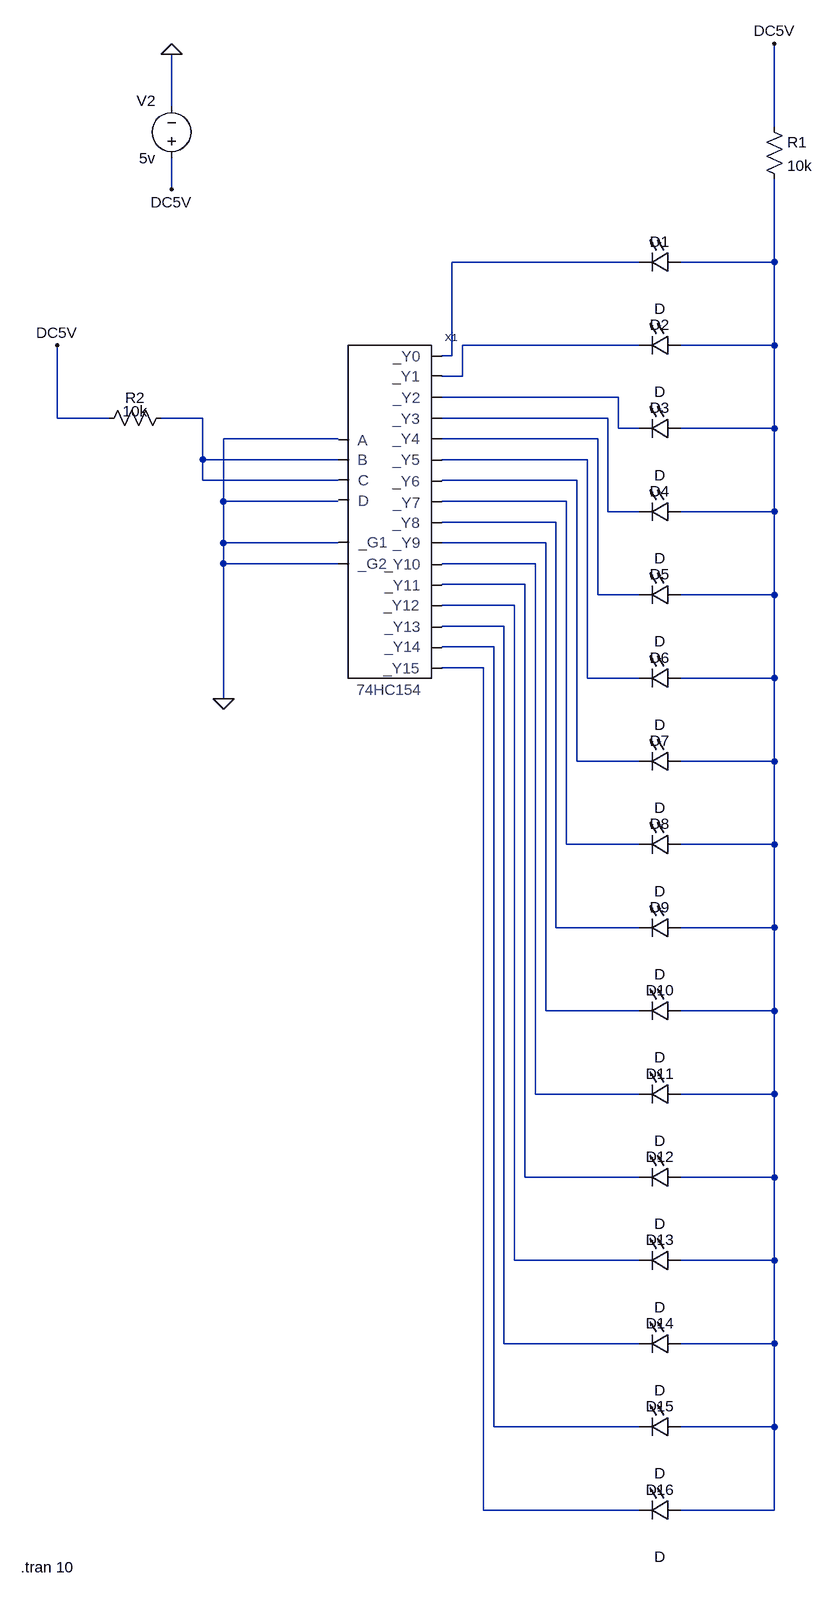
[diagram p0: schematic 74HC154_test.asc]
74HC154_test.asc, the LTspice schematic file:
Version 4
SHEET 1 880 1932
WIRE -272 -336 -272 -416
WIRE 656 -304 656 -432
WIRE -272 -208 -272 -256
WIRE 448 -96 160 -96
WIRE 656 -96 656 -224
WIRE 656 -96 512 -96
WIRE 448 32 176 32
WIRE 656 32 656 -96
WIRE 656 32 512 32
WIRE 160 48 160 -96
WIRE 160 48 144 48
WIRE 176 80 176 32
WIRE 176 80 144 80
WIRE 416 112 144 112
WIRE -448 144 -448 32
WIRE -368 144 -448 144
WIRE -224 144 -288 144
WIRE 400 144 144 144
WIRE 416 160 416 112
WIRE 448 160 416 160
WIRE 656 160 656 32
WIRE 656 160 512 160
WIRE -16 176 -192 176
WIRE 384 176 144 176
WIRE -224 208 -224 144
WIRE -16 208 -224 208
WIRE 368 208 144 208
WIRE -224 240 -224 208
WIRE -16 240 -224 240
WIRE 352 240 144 240
WIRE -192 272 -192 176
WIRE -16 272 -192 272
WIRE 336 272 144 272
WIRE 400 288 400 144
WIRE 448 288 400 288
WIRE 656 288 656 160
WIRE 656 288 512 288
WIRE 320 304 144 304
WIRE -192 336 -192 272
WIRE -16 336 -192 336
WIRE 304 336 144 336
WIRE -192 368 -192 336
WIRE -16 368 -192 368
WIRE 288 368 144 368
WIRE 272 400 144 400
WIRE 384 416 384 176
WIRE 448 416 384 416
WIRE 656 416 656 288
WIRE 656 416 512 416
WIRE 256 432 144 432
WIRE 240 464 144 464
WIRE 224 496 144 496
WIRE 208 528 144 528
WIRE 368 544 368 208
WIRE 448 544 368 544
WIRE 656 544 656 416
WIRE 656 544 512 544
WIRE -192 576 -192 368
WIRE 352 672 352 240
WIRE 448 672 352 672
WIRE 656 672 656 544
WIRE 656 672 512 672
WIRE 336 800 336 272
WIRE 448 800 336 800
WIRE 656 800 656 672
WIRE 656 800 512 800
WIRE 320 928 320 304
WIRE 448 928 320 928
WIRE 656 928 656 800
WIRE 656 928 512 928
WIRE 304 1056 304 336
WIRE 448 1056 304 1056
WIRE 656 1056 656 928
WIRE 656 1056 512 1056
WIRE 288 1184 288 368
WIRE 448 1184 288 1184
WIRE 656 1184 656 1056
WIRE 656 1184 512 1184
WIRE 272 1312 272 400
WIRE 448 1312 272 1312
WIRE 656 1312 656 1184
WIRE 656 1312 512 1312
WIRE 256 1440 256 432
WIRE 448 1440 256 1440
WIRE 656 1440 656 1312
WIRE 656 1440 512 1440
WIRE 240 1568 240 464
WIRE 448 1568 240 1568
WIRE 656 1568 656 1440
WIRE 656 1568 512 1568
WIRE 224 1696 224 496
WIRE 448 1696 224 1696
WIRE 656 1696 656 1568
WIRE 656 1696 512 1696
WIRE 208 1824 208 528
WIRE 448 1824 208 1824
WIRE 656 1824 656 1696
WIRE 656 1824 512 1824
FLAG -192 576 0
FLAG -272 -208 DC5V
FLAG -448 32 DC5V
FLAG 656 -432 DC5V
FLAG -272 -416 0
SYMBOL LED 512 -112 R90
WINDOW 0 0 32 VBottom 0
WINDOW 3 72 32 VTop 0
SYMATTR InstName D1
SYMBOL LED 512 16 R90
WINDOW 0 0 32 VBottom 0
WINDOW 3 72 32 VTop 0
SYMATTR InstName D2
SYMBOL LED 512 144 R90
WINDOW 0 0 32 VBottom 0
WINDOW 3 72 32 VTop 0
SYMATTR InstName D3
SYMBOL LED 512 272 R90
WINDOW 0 0 32 VBottom 0
WINDOW 3 72 32 VTop 0
SYMATTR InstName D4
SYMBOL LED 512 400 R90
WINDOW 0 0 32 VBottom 0
WINDOW 3 72 32 VTop 0
SYMATTR InstName D5
SYMBOL LED 512 528 R90
WINDOW 0 0 32 VBottom 0
WINDOW 3 72 32 VTop 0
SYMATTR InstName D6
SYMBOL LED 512 656 R90
WINDOW 0 0 32 VBottom 0
WINDOW 3 72 32 VTop 0
SYMATTR InstName D7
SYMBOL LED 512 784 R90
WINDOW 0 0 32 VBottom 0
WINDOW 3 72 32 VTop 0
SYMATTR InstName D8
SYMBOL LED 512 912 R90
WINDOW 0 0 32 VBottom 0
WINDOW 3 72 32 VTop 0
SYMATTR InstName D9
SYMBOL LED 512 1040 R90
WINDOW 0 0 32 VBottom 0
WINDOW 3 72 32 VTop 0
SYMATTR InstName D10
SYMBOL LED 512 1168 R90
WINDOW 0 0 32 VBottom 0
WINDOW 3 72 32 VTop 0
SYMATTR InstName D11
SYMBOL LED 512 1296 R90
WINDOW 0 0 32 VBottom 0
WINDOW 3 72 32 VTop 0
SYMATTR InstName D12
SYMBOL LED 512 1424 R90
WINDOW 0 0 32 VBottom 0
WINDOW 3 72 32 VTop 0
SYMATTR InstName D13
SYMBOL LED 512 1552 R90
WINDOW 0 0 32 VBottom 0
WINDOW 3 72 32 VTop 0
SYMATTR InstName D14
SYMBOL LED 512 1680 R90
WINDOW 0 0 32 VBottom 0
WINDOW 3 72 32 VTop 0
SYMATTR InstName D15
SYMBOL res 640 -320 R0
SYMATTR InstName R1
SYMATTR Value 10k
SYMBOL res -272 128 R90
WINDOW 0 0 56 VBottom 0
WINDOW 3 -10 56 VTop 0
SYMATTR InstName R2
SYMATTR Value 10k
SYMBOL voltage -272 -240 R180
WINDOW 0 24 104 Left 0
WINDOW 3 24 16 Left 0
WINDOW 123 0 0 Left 0
WINDOW 39 0 0 Left 0
SYMATTR InstName V2
SYMATTR Value 5v
SYMBOL LED 512 1808 R90
WINDOW 0 0 32 VBottom 0
WINDOW 3 72 32 VTop 0
SYMATTR InstName D16
SYMBOL 74HC154 64 272 R0
SYMATTR InstName X1
TEXT -504 1912 Left 0 !.tran 10

The netlist it stands for:
* 74HC154_test.asc
D1 N002 N001 D
D2 N002 N003 D
D3 N002 N004 D
D4 N002 N006 D
D5 N002 N007 D
D6 N002 N008 D
D7 N002 N009 D
D8 N002 N010 D
D9 N002 N011 D
D10 N002 N012 D
D11 N002 N013 D
D12 N002 N014 D
D13 N002 N015 D
D14 N002 N016 D
D15 N002 N017 D
R1 DC5V N002 10k
R2 N005 DC5V 10k
V2 DC5V 0 5v
D16 N002 N018 D
XX1 0 N005 N005 0 0 0 N001 N003 N004 N006 N007 N008 N009 N010 N011 N012 N013 N014 N015 N016 N017 N018 74HC154  ; pins A B C D _G1 _G2 _Y0 _Y1 _Y2 _Y3 _Y4 _Y5 _Y6 _Y7 _Y8 _Y9 _Y10 _Y11 _Y12 _Y13 _Y14 _Y15
.model D D
.lib standard.dio
.tran 10
.backanno
.end